# Altium project Simple_EEM_Controller.PrjPCB (part 5 of 5)

## Sheet WR-Clocks.SchDoc: =SheetTitle_Top
size 420 x 297 mm; EDA_Number: ARTIQ; Projet: Simple EEM Controller; Author: G.Kasprowicz; CompanyName: WUT ISE; DrawnBy: G.Kasprowicz; Organization: WUT ISE; Address1: PW ISE; Address2: Nowowiejska 15/19 00-665 Warsaw; Address3: gkasprow@gmail.com; Revision: 1.0; ModifiedBy: -; CheckedDate: -; Title2: WR Clocks; DivGrp: WUT ISE; Designer: G.Kasprowicz; ModifiedDate: -; ProjectName: Sensor Box
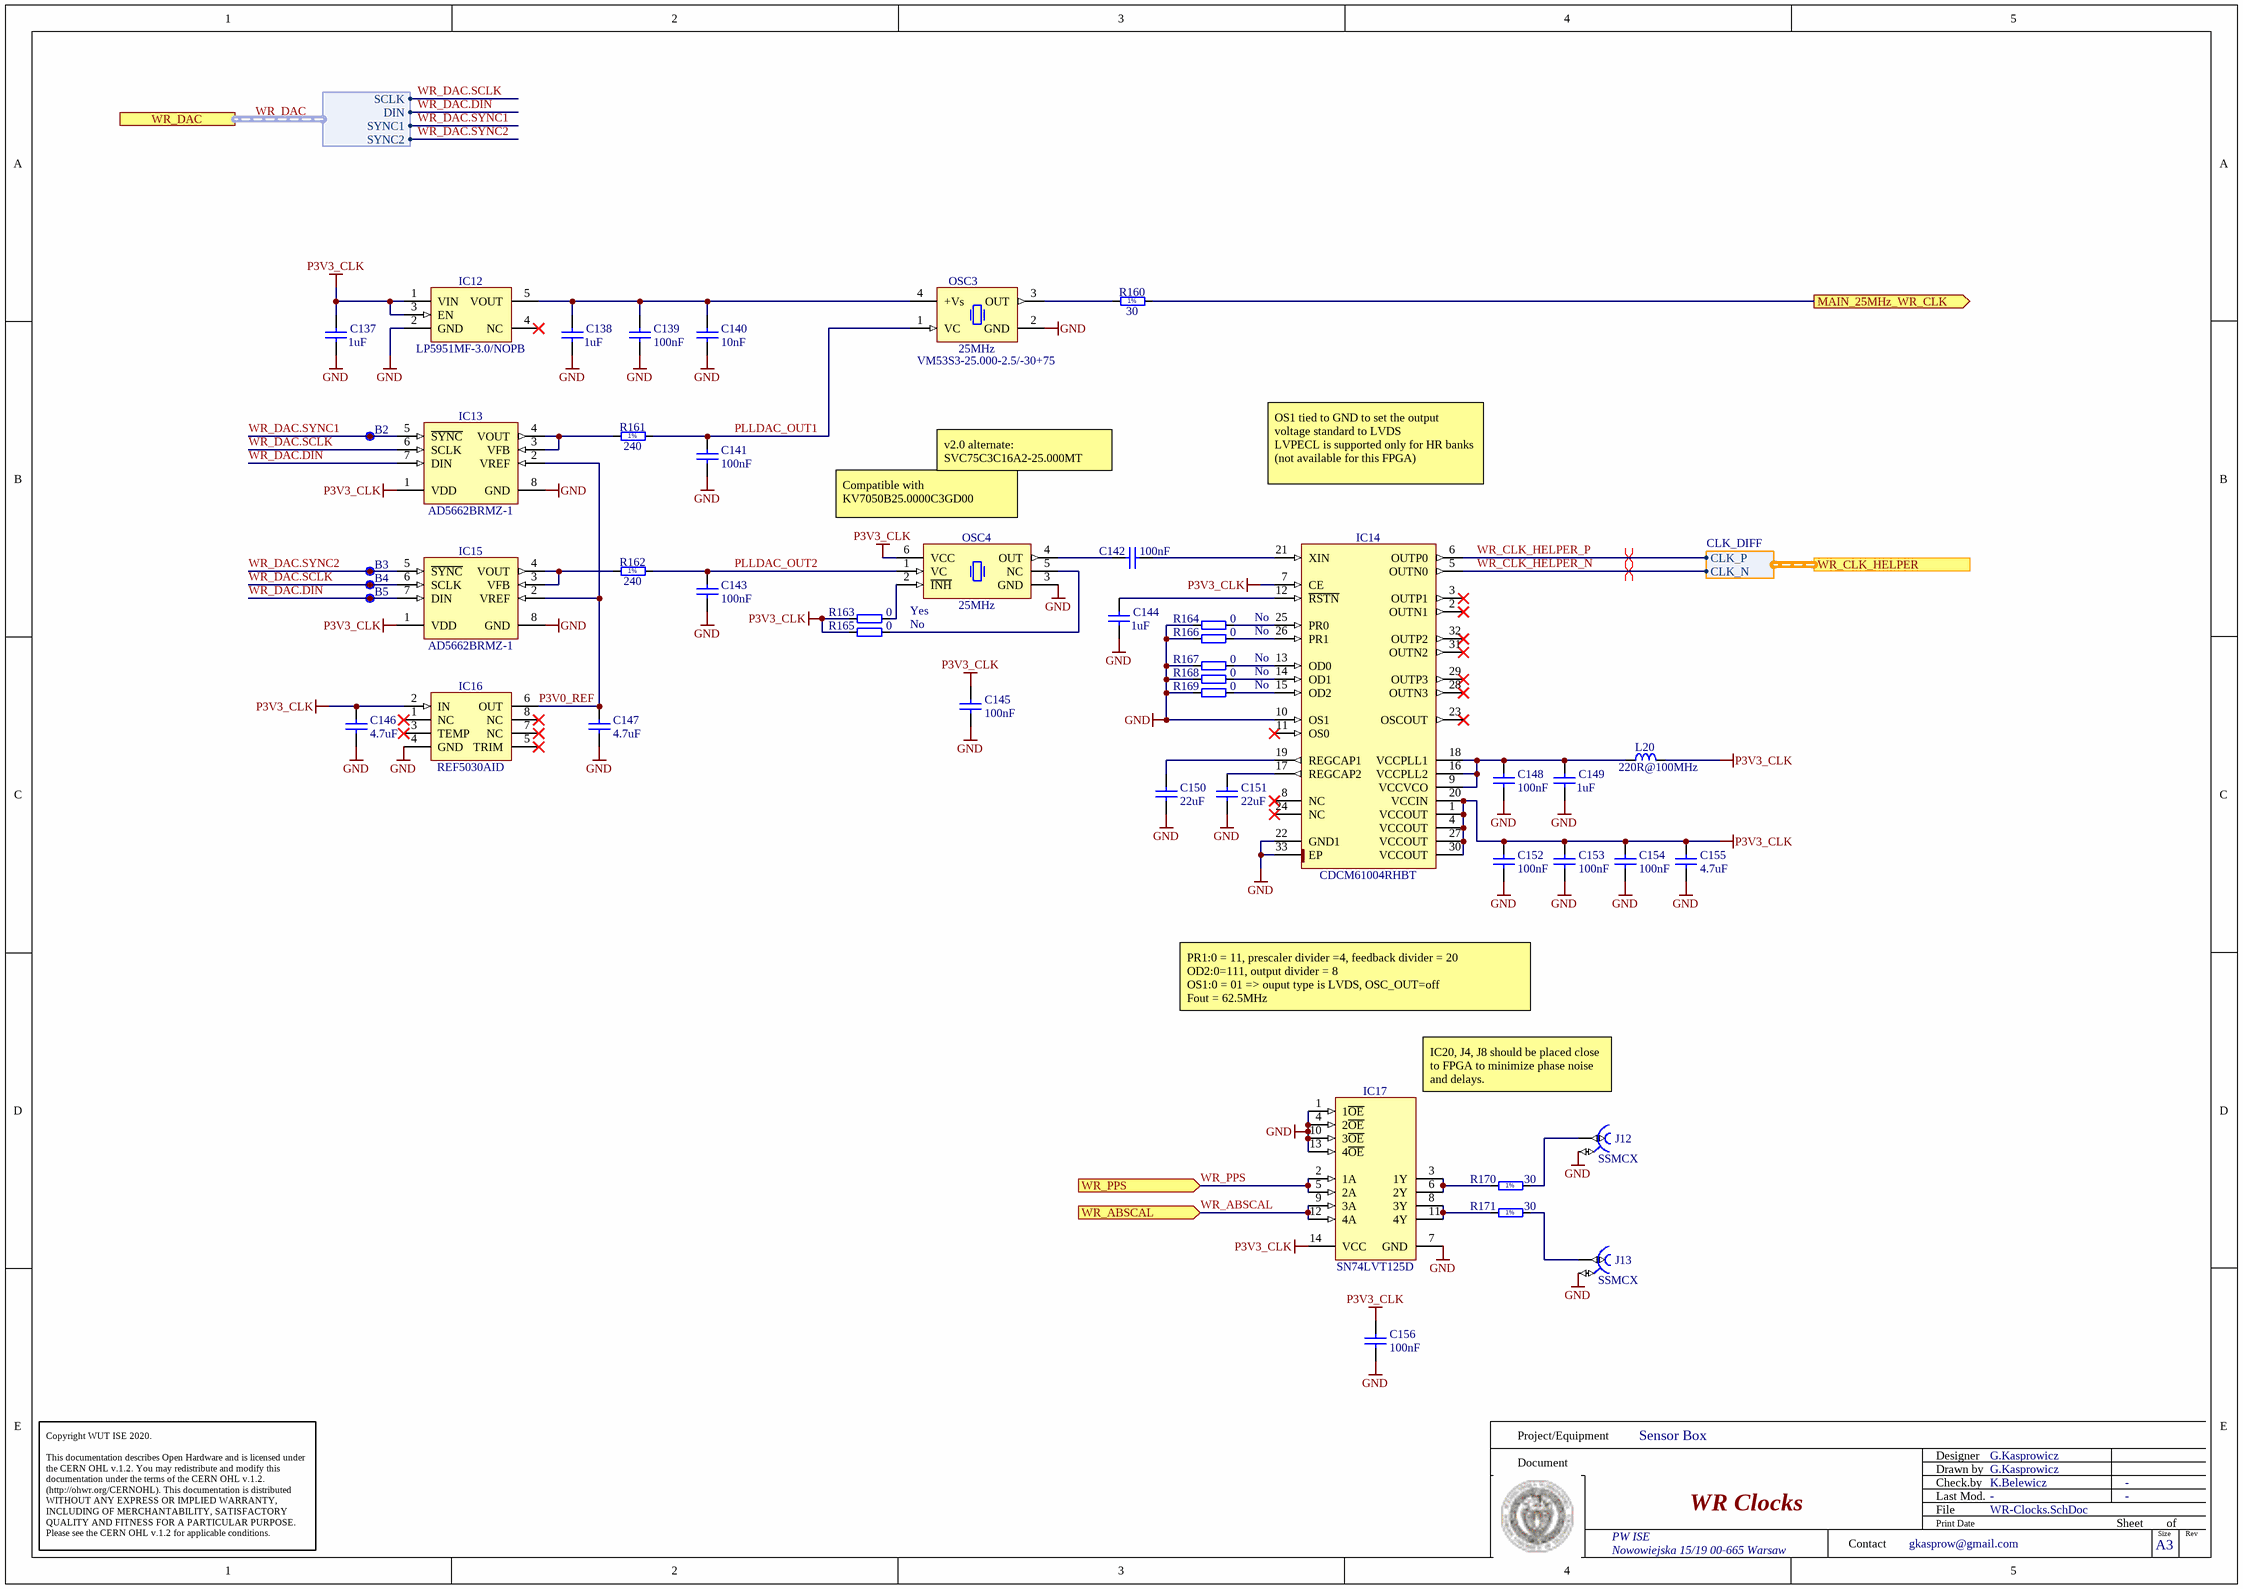
[diagram p10: WR-Clocks.SchDoc]

### Parts
B2  SMD Pad  [C100]  (value not drawn)  (no BOM)
B3  SMD Pad  [C100]  (value not drawn)  (no BOM)
B4  SMD Pad  [C100]  (value not drawn)  (no BOM)
B5  SMD Pad  [C100]  (value not drawn)  (no BOM)
C137  1uF  [CAPC1005X55N]
C138  1uF  [CAPC1005X55N]
C139  100nF  [CAPC1005X55N]
C140  10nF  [CAPC1005X55N]
C141  100nF  [CAPC1005X55N]
C142  100nF  [CAPC1005X55N]
C143  100nF  [CAPC1005X55N]
C144  1uF  [CAPC1005X55N]
C145  100nF  [CAPC1005X55N]
C146  4.7uF  [CAPC1005X55N]
C147  4.7uF  [CAPC1005X55N]
C148  100nF  [CAPC1005X55N]
C149  1uF  [CAPC1005X55N]
C150  22uF  [CAPC1709X100N]
C151  22uF  [CAPC1709X100N]
C152  100nF  [CAPC1005X55N]
C153  100nF  [CAPC1005X55N]
C154  100nF  [CAPC1005X55N]
C155  4.7uF  [CAPC1005X55N]
C156  100nF  [CAPC1005X55N]
IC12  LP5951MF-3.0/NOPB  [SOT95P284X122-5N]
IC13  AD5662BRMZ-1  [SOP65P490X110-8N]
IC14  CDCM61004RHBT  [QFN50P500X500X100-33N-S355]
IC15  AD5662BRMZ-1  [SOP65P490X110-8N]
IC16  REF5030AID  [SOIC127P600X175-8N]
IC17  SN74LVT125D  [SOIC127P600X175-14N]
J12  SSMCX  [MOLEX_73413-0040]
J13  SSMCX  [MOLEX_73413-0040]
L20  220R@100MHz  [INDC2012X105N]
OSC3  25MHz  Manufacturer Part Number: VM53S3-25.000-2.5/-30+75  [OSCCC320X500X160-4N]
OSC4  25MHz  [OSC_KYOCERA_KV7050B-C3]
R160  30  [RESC1005X40N]
R161  240  [RESC1005X40N]
R162  240  [RESC1005X40N]
R163  0  Mounted: Yes  [RESC1005X40N]
R164  0  Mounted: No  [RESC1005X40N]
R165  0  Mounted: No  [RESC1005X40N]
R166  0  Mounted: No  [RESC1005X40N]
R167  0  Mounted: No  [RESC1005X40N]
R168  0  Mounted: No  [RESC1005X40N]
R169  0  Mounted: No  [RESC1005X40N]
R170  30  [RESC1005X40N]
R171  30  [RESC1005X40N]

### Ports
MAIN_25MHz_WR_CLK (out), WR_ABSCAL (in), WR_CLK_HELPER (harness CLK_DIFF), WR_DAC (harness WR_DAC_H), WR_PPS (in)

### Harnesses
WR_DAC_H: SYNC1, SCLK, SYNC2, DIN
CLK_DIFF: CLK_P, CLK_N

### Nets
GND: C137.1 C138.1 C139.1 C140.1 C141.1 C143.1 C144.1 C145.1 C146.1 C147.1 C148.1 C149.1 C150.1 C151.1 C152.1 C153.1 C154.1 C155.1 C156.1 IC12.2(GND) IC13.8(GND) IC14.10(OS1) IC14.22(GND1) IC14.33(EP) IC15.8(GND) IC16.4(GND) IC17.1(1~{OE}) IC17.4(2~{OE}) IC17.7(GND) IC17.10(3~{OE}) IC17.13(4~{OE}) J12.2 J13.2 OSC3.2(GND) OSC4.3(GND) R164.1 R166.1 R167.1 R168.1 R169.1
P3V3_CLK: C137.2 C145.2 C146.2 C152.2 C153.2 C154.2 C155.2 C156.2 IC12.1(VIN) IC12.3(EN) IC13.1(VDD) IC14.1(VCCOUT) IC14.4(VCCOUT) IC14.7(CE) IC14.20(VCCIN) IC14.27(VCCOUT) IC14.30(VCCOUT) IC15.1(VDD) IC16.2(IN) IC17.14(VCC) L20.2 OSC4.6(VCC) R163.1 R165.1
MAIN_25MHz_WR_CLK: R160.2 ; port MAIN_25MHz_WR_CLK
P3V0_REF: C147.2 IC13.2(VREF) IC15.2(VREF) IC16.6(OUT)
PLLDAC_OUT1: C141.2 OSC3.1(VC) R161.2
PLLDAC_OUT2: C143.2 OSC4.1(VC) R162.2
WR_ABSCAL: IC17.9(3A) IC17.12(4A) ; port WR_ABSCAL  [project net HDA.HDA00_CC]
WR_CLK_HELPER_N: IC14.5(OUTN0) ; port WR_CLK_HELPER.CLK_N  [project net HPB15_CC_N]
WR_CLK_HELPER_P: IC14.6(OUTP0) ; port WR_CLK_HELPER.CLK_P  [project net HPB15_CC_P]
WR_DAC.DIN: B5.1 IC13.7(DIN) IC15.7(DIN) ; port WR_DAC.DIN  [project net HDA.HDA05]
WR_DAC.SCLK: B4.1 IC13.6(SCLK) IC15.6(SCLK) ; port WR_DAC.SCLK  [project net HDA.HDA04]
WR_DAC.SYNC1: B2.1 IC13.5(~{SYNC}) ; port WR_DAC.SYNC1  [project net HDA.HDA06]
WR_DAC.SYNC2: B3.1 IC15.5(~{SYNC}) ; port WR_DAC.SYNC2  [project net HDA.HDA07]
WR_PPS: IC17.2(1A) IC17.5(2A) ; port WR_PPS  [project net HDA.HDA01]
NetC138_2: C138.2 C139.2 C140.2 IC12.5(VOUT) OSC3.4(+Vs)
NetC142_1: C142.1 IC14.21(XIN)
NetC142_2: C142.2 OSC4.4(OUT)
NetC144_2: C144.2 IC14.12(~{RSTN})
NetC148_2: C148.2 C149.2 IC14.9(VCCVCO) IC14.16(VCCPLL2) IC14.18(VCCPLL1) L20.1
NetC150_2: C150.2 IC14.19(REGCAP1)
NetC151_2: C151.2 IC14.17(REGCAP2)
NetIC13_3: IC13.3(VFB) IC13.4(VOUT) R161.1
NetIC14_13: IC14.13(OD0) R167.2
NetIC14_14: IC14.14(OD1) R168.2
NetIC14_15: IC14.15(OD2) R169.2
NetIC14_25: IC14.25(PR0) R164.2
NetIC14_26: IC14.26(PR1) R166.2
NetIC15_3: IC15.3(VFB) IC15.4(VOUT) R162.1
NetIC17_3: IC17.3(1Y) IC17.6(2Y) R170.1
NetIC17_8: IC17.8(3Y) IC17.11(4Y) R171.1
NetJ12_1: J12.1 R170.2
NetJ13_1: J13.1 R171.2
NetOSC3_3: OSC3.3(OUT) R160.1
NetOSC4_2: OSC4.2(~{INH}) R163.2
NetOSC4_5: OSC4.5(NC) R165.2

Not connected (* = marked no-connect by the designer): IC12 4(NC)*; IC14 2(OUTN1)* 3(OUTP1)* 8(NC)* 11(OS0)* 23(OSCOUT)* 24(NC)* 28(OUTN3)* 29(OUTP3)* 31(OUTN2)* 32(OUTP2)*; IC16 1(NC)* 3(TEMP)* 5(TRIM)* 7(NC)* 8(NC)*

### Buses and harness runs
harness WR_DAC = port WR_DAC

### Layout directives
differential pair: HPB15_CC_N, HPB15_CC_P

### Notes on the sheet
- (near OSC4) Compatible with KV7050B25.0000C3GD00
- v2.0 alternate: SVC75C3C16A2-25.000MT
- OS1 tied to GND to set the output voltage standard to LVDS
  LVPECL is supported only for HR banks (not available for this FPGA)
- PR1:0 = 11, prescaler divider =4, feedback divider = 20
  OD2:0=111, output divider = 8
  OS1:0 = 01 => ouput type is LVDS, OSC_OUT=off
  Fout = 62.5MHz
- (near IC17) IC20, J4, J8 should be placed close to FPGA to minimize phase noise and delays.
- Project/Equipment
- Document
- Designer
- Drawn by
- Check.by
- Copyright WUT ISE 2020.
  This documentation describes Open Hardware and is licensed under the CERN OHL v.1.2. You may redistribute and modify this documentation under the terms of the CERN OHL v.1.2. (http://ohwr.org/CERNOHL). This documentation is distributed WITHOUT ANY EXPRESS OR IMPLIED WARRANTY, INCLUDING OF MERCHANTABILITY, SATISFACTORY QUALITY AND FITNESS FOR A PARTICULAR PURPOSE. Please see the CERN OHL v.1.2 for applicable conditions.
- Contact
- File
- Last Mod.
- Print Date
- Sheet
- Size
- A3
- of
- Rev
- (in symbol R0402_30R_1%_0.0625W_100PPM) 1%
- (in symbol R0402_240R_1%_0.0625W_100PPM) 1%

### Library data of the parts
B2-B5 = SMD_PAD_D1MM: Through Hole Pad; Part Description: 1mm Diameter SMD Pad; Mounted: No; Part Number: SMD_PAD_D1MM; Component Type: Standard (No BOM); Pin Count: 1; Family: SMD Pad; Socket: No; SMD: No; Sense: No; Status: None; ComponentHeight: 0mm; HelpURL: Undefined; Author: CERN DEM JLC; CreateDate: 10.10.2017; LatestRevisionDate: 10.10.2017; PackageDescription: 1mm Diameter SMD Pad
C137 C138 C144 C149 = CC0402_1UF_16V_10%_X5R: Non-polarised capacitor; Part Description: SMD Multilayer Chip Ceramic Capacitor; Manufacturer: GENERIC; Manufacturer1 Part Number: C1005X5R1C105KT; Voltage: 16V; TC: X5R; Tolerance: ±10%; Part Number: CC0402_1UF_16V_10%_X5R; Component Kind: Standard; Component Type: Standard; Pin Count: 2; Value: 1uF; Status: Preferred; Manufacturer Part Number: CC0402_1UF_16V_10%_X5R; Case: 0402; Mounted: Yes; Socket: No; SMD: Yes; Sense: No; Manufacturer1 Example: TDK; Manufacturer1 ComponentHeight: 0.55mm; HelpURL: \\cern.ch\dfs\Applications\Altium\Datasheets\CC0402_X5R_TDK_C.pdf; Author: CERN DEM JLC; CreateDate: 2012-10-25; LatestRevisionDate: 2012-10-25
C139 C141-C143 C145 C148 C152-C154 C156 = CC0402_100NF_16V_10%_X5R: Non-polarised capacitor; Part Description: SMD Multilayer Chip Ceramic Capacitor; Manufacturer: GENERIC; Manufacturer1 Part Number: GRM155R61C104KA88D; Voltage: 16V; TC: X5R; Tolerance: ±10%; Part Number: CC0402_100NF_16V_10%_X5R; Component Kind: Standard; Component Type: Standard; Pin Count: 2; Value: 100nF; Status: None; Manufacturer Part Number: CC0402_100NF_16V_10%_X5R; Case: 0402; Mounted: Yes; Socket: No; SMD: Yes; Sense: No; Manufacturer1 Example: MURATA; Manufacturer1 ComponentHeight: 0.55mm; HelpURL: \\cern.ch\dfs\Applications\Altium\Datasheets\CC0402_X5R_MURATA_GRM.pdf; Author: CERN DEM JLC; CreateDate: 10.12.2013; LatestRevisionDate: 10.12.2013
C140 = CC0402_10NF_16V_10%_X7R: Non-polarised capacitor; Part Description: SMD Multilayer Chip Ceramic Capacitor; Manufacturer: GENERIC; Manufacturer1 Part Number: 223878715636; Voltage: 16V; TC: X7R; Tolerance: ±10%; Part Number: CC0402_10NF_16V_10%_X7R; Component Kind: Standard; Component Type: Standard; Pin Count: 2; Value: 10nF; Status: Not Recommended; Manufacturer Part Number: CC0402_10NF_16V_10%_X7R; Case: 0402; Mounted: Yes; Socket: No; SMD: Yes; Sense: No; Manufacturer1 Example: PHYCOMP; Manufacturer1 ComponentHeight: 0.55mm; HelpURL: \\cern.ch\dfs\Applications\Altium\Datasheets\CC0402_X7R_PHYCOMP.pdf; Author: CERN DEM JLC; CreateDate: 03.12.2007; LatestRevisionDate: 03.12.2007
C146 C147 C155 = CC0402_4.7UF_6.3V_20%_X5R: Non-polarised capacitor; Part Description: SMD Multilayer Chip Ceramic Capacitor; Manufacturer: GENERIC; Manufacturer1 Part Number: C1005X5R0J475M050BC; Voltage: 6.3V; TC: X5R; Tolerance: ±20%; Part Number: CC0402_4.7UF_6.3V_20%_X5R; Component Kind: Standard; Component Type: Standard; Pin Count: 2; Value: 4.7uF; Status: Preferred; Manufacturer Part Number: CC0402_4.7UF_6.3V_20%_X5R; Case: 0402; Mounted: Yes; Socket: No; SMD: Yes; Manufacturer1 Example: TDK; Manufacturer1 ComponentHeight: 0.65mm; HelpURL: \\cern.ch\dfs\Applications\Altium\Datasheets\CC0402_X5R_TDK_C.pdf; Author: CERN DEM JLC; CreateDate: 03-Mar-15; LatestRevisionDate: 03-Mar-15; Sense: No
C150 C151 = CC0603_22UF_6.3V_20%_X5R: Non-polarised capacitor; Part Description: SMD Multilayer Chip Ceramic Capacitor; Manufacturer: GENERIC; Manufacturer1 Part Number: C1608X5R0J226M080AC; Voltage: 6.3V; TC: X5R; Tolerance: ±20%; Part Number: CC0603_22UF_6.3V_20%_X5R; Component Kind: Standard; Component Type: Standard; Pin Count: 2; Value: 22uF; Status: None; Manufacturer Part Number: CC0603_22UF_6.3V_20%_X5R; Case: 0603; Mounted: Yes; Socket: No; SMD: Yes; Manufacturer1 Example: TDK; Manufacturer1 ComponentHeight: 1mm; HelpURL: \\cern.ch\dfs\Applications\Altium\Datasheets\CC0603_X5R_TDK_C.pdf; Author: CERN DEM JLC; CreateDate: 16-Dec-13; LatestRevisionDate: 13-Sep-16; Sense: No
IC12 = LP5951MF-3.0/NOPB: 150mA Micropower Low-Dropout CMOS Voltage Regulator; Part Description: 3V,  150mA Micropower Low-Dropout CMOS Voltage Regulator; Manufacturer: NATIONAL SEMICONDUCTOR; Table: Regulators; Article#: 16843; Placement Order ID: SMD_SOT&SOD; Part Number: LP5951MF-3.0/NOPB; Component Kind: Standard; Component Type: Standard; Device: LP5951MF-3.0/NOPB; PackageDescription: SOT23 5, Pitch 0.95mm - Body 1.67x2.99mm, IPC Medium Density; Manufacturer Part Number: LP5951MF-3.0/NOPB; Pin Count: 5; Case: SOT23-5; Mounted: Yes; Socket: No; SMD: Yes; ComponentHeight: 1.19mm; HelpURL: \\cern.ch\dfs\Applications\Altium\Datasheets\LP5951MF-3.0-NOPB.pdf; Author: CERN DEM JLC; CreateDate: 24/01/2011; LatestRevisionDate: 24/01/2011
IC13 IC15 = AD5662BRMZ-1: 2.7V to 5.5V, 250uA, Rail-to-Rail Output 16-Bit nanoDAC; Manufacturer: ANALOG DEVICES; Table: Analog & Interface; Article#: 16755; Placement Order ID: SMD_GULL_WING; Part Number: AD5662BRMZ-1; Component Kind: Standard; Component Type: Standard; Device: AD5662BRMZ-1; PackageDescription: SOP, 8-Leads, Body 3.0x3.0mm, Pitch 0.65mm, IPC Medium Density; Part Description: 2.7V to 5.5V, 250uA, Rail-to-Rail Output 16-Bit nanoDAC; Manufacturer Part Number: AD5662BRMZ-1; Pin Count: 8; Case: MSOP8; Mounted: Yes; Socket: No; SMD: Yes; ComponentHeight: 1.1mm; Author: CERN DEM JLC; HelpURL: \\cern.ch\dfs\Applications\Altium\Datasheets\AD5662BRMZ-1.pdf; CreateDate: 1/10/2011; LatestRevisionDate: 1/10/2011
IC14 = CDCM61004RHBT: Four Output, Integrated VCO, Low-Jitter Clock Generator; Manufacturer: TEXAS INSTRUMENTS; Table: Logic; Article#: 16910; Placement Order ID: SMD_PASTE; Part Number: CDCM61004RHBT; Component Kind: Standard; Component Type: Standard; Device: CDCM61004RHBT; PackageDescription: QFN, (MO-220-VHHD-4) 0.50mm pitch,square; 8 pin X 8 pin, 5mm X 5mm X 1.00mm H body (w/thermal tab 3.5 X 3.5mm),  IPC Medium Density; Part Description: Four Output, Integrated VCO, Low-Jitter Clock Generator; Manufacturer Part Number: CDCM61004RHBT; Pin Count: 33; Case: QFN32; Mounted: Yes; Socket: No; SMD: Yes; ComponentHeight: 1mm; HelpURL: \\cern.ch\dfs\Applications\Altium\Datasheets\CDCM61004RHBT.pdf; Author: CERN DEM JLC; CreateDate: 25/08/2010; LatestRevisionDate: 21/11/2011
IC16 = REF5030AID: Low-Noise, Very Low Drift, Precision Voltage Reference; Part Description: 3V, Low-Noise, Very Low Drift, Precision Voltage Reference; Manufacturer: TEXAS INSTRUMENTS; PressFit: No; Bonding: No; Part Number: REF5030AID; Component Kind: Standard; Component Type: Standard; Device: REF5030AID; PackageDescription: SOIC 8, Pitch 1.27mm, Body 4x5mm, IPC Medium Density; Manufacturer Part Number: REF5030AID; Pin Count: 8; Case: SOIC8; Mounted: Yes; Socket: No; SMD: Yes; ComponentHeight: 1.75mm; HelpURL: \\cern.ch\dfs\Applications\Altium\Datasheets\REF5030AID.pdf; Author: CERN DEM MR; CreateDate: 14-Oct-16; LatestRevisionDate: 14-Oct-16; Sense: No
IC17 = SN74LVT125D: Quadruple Bus Buffer with 3-State Outputs; Part Description: 3.3V ABT Quadruple Bus Buffer with 3-State Outputs; Manufacturer: TEXAS INSTRUMENTS; PressFit: No; Bonding: No; Part Number: SN74LVT125D; Component Kind: Standard; Component Type: Standard; Device: SN74LVT125D; PackageDescription: SOIC 14, Pitch 1.27mm - Body 4x8.75mm, IPC Medium Density; Manufacturer Part Number: SN74LVT125D; Pin Count: 14; Case: SOIC14; Mounted: Yes; Socket: No; SMD: Yes; Sense: No; ComponentHeight: 1.75mm; Author: CERN DEM JLC; HelpURL: \\cern.ch\dfs\Applications\Altium\Datasheets\SN74LVT125D.pdf; CreateDate: 01-Jun-11; LatestRevisionDate: 01-Jun-11
J12 J13 = MOLEX_73413-0040: Part Description: 50 Ohm, Magnetic Vertical SSMCX Jack; Manufacturer: MOLEX; PressFit: No; Part Number: MOLEX_73413-0040; Component Kind: Standard; Component Type: Standard; Pin Count: 2; Family: SSMCX; Mounted: Yes; Socket: No; SMD: Yes; Sense: No; Status: None; Manufacturer Part Number: 73413-0040; ComponentHeight: 3.35mm; HelpURL: \\cern.ch\dfs\Applications\Altium\Datasheets\MOLEX_73413-0040.pdf; Author: CERN DEM JLC; CreateDate: 31-May-17; LatestRevisionDate: 29-Jan-18
L20 = IND0805_MURATA_BLM21PG221SN1D: Inductor; Part Description: SMD EMIFIL Suppression Chip Ferrite Bead; Manufacturer: MURATA; Power: 2A; Resistance: 0.05R; Tolerance: ±25%; Table: Inductors SMD; Part Number: IND0805_MURATA_BLM21PG221SN1D; Component Kind: Standard; Component Type: Standard; Pin Count: 2; Value: 220R@100MHz; Status: None; Manufacturer Part Number: BLM21PG221SN1D; Case: 0805; Mounted: Yes; Socket: No; SMD: Yes; ComponentHeight: 1.05mm; HelpURL: \\cern.ch\dfs\Applications\Altium\Datasheets\IND0402_MURATA_BLM21P.pdf; Author: CERN DEM JLC; CreateDate: 25/01/2010; LatestRevisionDate: 25/01/2010
OSC3 = OSC_25MHZ_MERCURY_VM53S3-25.000-2.5/-30+75: Oscillator 4 pins 1=VC 2=GND 3=OUT 4=+Vs; Part Description: 3V ±2.5ppmVoltage Controlled Temperature Compensated Crystal Oscillator VM53S3 Serie; Manufacturer: MERCURY ELECTRONICS; Table: Crystals & Oscillators; Article#: 16765; Placement Order ID: SMD_LEADLESS; Part Number: OSC_25MHZ_MERCURY_VM53S3-25.000-2.5/-30+75; Component Kind: Standard; Component Type: Standard; PackageDescription: SMD Oscillator, Corner Convave, 4 pins, 5x3.2mm; Value: 25MHz; Pin Count: 4; Mounted: Yes; Socket: No; SMD: Yes; ComponentHeight: 1.6mm; HelpURL: \\cern.ch\dfs\Applications\Altium\Datasheets\OSC_MERCURY_VM53S3.pdf; Author: CERN DEM JLC; CreateDate: 1/20/2010; LatestRevisionDate: 1/24/2011
OSC4 = OSC_25MHZ_KYOCERA_KV7050B25.0000C3GD00: Oscillator KYOCERA; Part Description: ±50ppm, 15pF, Supply Voltage 3.3V, -40°C to +85°C, Surface Mount Crystal Oscillator VCXO, KV7050B-C3 Series; PressFit: No; Bonding: No; Part Number: OSC_25MHZ_KYOCERA_KV7050B25.0000C3GD00; Component Kind: Standard; Component Type: Standard; PackageDescription: SMD Crystal Kyocera, 6 Pin, 7mm L X 5mm W X 1.6mm H; Value: 25MHz; Manufacturer: KYOCERA; Manufacturer Part Number: KV7050B25.0000C3GD00; Pin Count: 6; Mounted: Yes; Socket: No; SMD: Yes; Sense: No; ComponentHeight: 1.6mm; HelpURL: \\cern.ch\dfs\Applications\Altium\Datasheets\OSC_KYOCERA_KV7050B-C3.pdf; Author: CERN DEM MR; CreateDate: 01.10.2019; LatestRevisionDate: 01.10.2019
R160 R170 R171 = R0402_30R_1%_0.0625W_100PPM: Resistor - 1%; Part Description: General Purpose Thick Film Chip Resistor; Manufacturer: GENERIC; Manufacturer1 Part Number: 232270673009L; TC: ±100ppm/°C; PressFit: No; Part Number: R0402_30R_1%_0.0625W_100PPM; Component Kind: Standard; Component Type: Standard; Pin Count: 2; Value: 30; Status: Not Recommended; Power: 0.0625W; Tolerance: ±1%; Manufacturer Part Number: R0402_30R_1%_0.0625W_100PPM; Case: 0402; Mounted: Yes; Socket: No; SMD: Yes; Manufacturer1 Example: YAGEO PHYCOMP; Manufacturer1 ComponentHeight: 0.4mm; HelpURL: \\cern.ch\dfs\Applications\Altium\Datasheets\R0402_Phycomp_RC0402.pdf; Author: CERN DEM JLC; CreateDate: 03/12/2007; LatestRevisionDate: 17/10/2012; Sense: No
R161 R162 = R0402_240R_1%_0.0625W_100PPM: Resistor - 1%; Part Description: General Purpose Thick Film Chip Resistor; Manufacturer: GENERIC; Manufacturer1 Part Number: 232270672401L; TC: ±100ppm/°C; PressFit: No; Part Number: R0402_240R_1%_0.0625W_100PPM; Component Kind: Standard; Component Type: Standard; Pin Count: 2; Value: 240; Status: Not Recommended; Power: 0.0625W; Tolerance: ±1%; Manufacturer Part Number: R0402_240R_1%_0.0625W_100PPM; Case: 0402; Mounted: Yes; Socket: No; SMD: Yes; Manufacturer1 Example: YAGEO PHYCOMP; Manufacturer1 ComponentHeight: 0.4mm; HelpURL: \\cern.ch\dfs\Applications\Altium\Datasheets\R0402_Phycomp_RC0402.pdf; Author: CERN DEM JLC; CreateDate: 03-Dec-07; LatestRevisionDate: 17-Oct-12; Sense: No
R163-R169 = R0402_0R_JUMPER: Resistor; Part Description: 1A (0.05R Max DC Resistance) Zero Ohm Jumper; Manufacturer: GENERIC; Manufacturer1 Part Number: 232270591001L; PressFit: No; Part Number: R0402_0R_JUMPER; Component Kind: Standard; Component Type: Standard; Pin Count: 2; Value: 0; Status: Not Recommended; Manufacturer Part Number: R0402_0R_JUMPER; Case: 0402; Sense: No; Socket: No; SMD: Yes; Manufacturer1 Example: YAGEO PHYCOMP; Manufacturer1 ComponentHeight: 0.4mm; HelpURL: \\cern.ch\dfs\Applications\Altium\Datasheets\R0402_Phycomp_RC0402.pdf; Author: CERN DEM JLC; CreateDate: 03.12.2007; LatestRevisionDate: 17.10.2012

## Nets that join several sheets
CHASSIS: Simple_EEM_Controller (C97.1 M2.1 R129.1 R220.2), Connector_ETH (J3.SHIELD)
GND: Simple_EEM_Controller (5 pins), Connector_SFP (61 pins), Connector_ETH (40 pins), Connector_EEM (52 pins), Connector_SOM240_1 (108 pins), Connector_SOM240_2 (86 pins), Connector_SOM40 (24 pins), Power_Supply (88 pins), Clocks (26 pins), WR-Clocks (40 pins)
P1V1_ETH: Connector_ETH (L13.1 L14.1 L15.1), Power_Supply (5 pins)
P1V8_CLK: Power_Supply (C105.2 C106.2 L19.2 TP16.1), Clocks (29 pins)
P1V8_ETH: Connector_ETH (L12.1), Power_Supply (5 pins)
P1V8_SOM_PL: Connector_SOM240_1 (5 pins), Connector_SOM240_2 (8 pins), Power_Supply (7 pins), Clocks (C118.2 OSC2.1 OSC2.4)
P3V3_CLK: Power_Supply (C101.2 C102.2 L17.2 TP15.1), Clocks (11 pins), WR-Clocks (24 pins)
P3V3_EEM: Connector_EEM (28 pins), Power_Supply (L21.2 R177.2 TP4.1)
P3V3_ETH: Connector_ETH (J3.11 J3.13 L11.1), Power_Supply (9 pins)
P3V3_SFP: Connector_SFP (20 pins), Power_Supply (L22.2 R178.2 TP19.1)
P3V3_SOM_PL: Connector_EEM (R132.2 R133.2), Connector_SOM240_1 (C76.2 C77.2 J5.B13 J5.B14), Connector_SOM240_2 (6 pins), Power_Supply (16 pins)
P5V0_SOM: Connector_SOM240_1 (12 pins), Power_Supply (20 pins)
P12V0: Connector_EEM (8 pins), Power_Supply (17 pins)
ETH_MDC: Connector_ETH (IC2.51 R84.1), Connector_SOM240_1 (J5.D37)
ETH_MDIO: Connector_ETH (IC2.52 R83.1), Connector_SOM240_1 (J5.D36)
ETH_RX_CLK: Connector_ETH (R88.2 R99.1), Connector_SOM240_1 (J5.D41)
ETH_RX_CTL: Connector_ETH (R93.2 R98.1 R101.2), Connector_SOM240_1 (J5.D45)
ETH_RXD0: Connector_ETH (R89.2 R104.2), Connector_SOM240_1 (J5.C39)
ETH_RXD1: Connector_ETH (R90.2 R103.2), Connector_SOM240_1 (J5.D42)
ETH_RXD2: Connector_ETH (R91.2 R102.2), Connector_SOM240_1 (J5.B44)
ETH_RXD3: Connector_ETH (R92.2 R100.1), Connector_SOM240_1 (J5.D44)
ETH_TX_CLK: Connector_ETH (IC2.33), SOM (R56.2)
ETH_TX_CTL: Connector_ETH (IC2.34), SOM (R47.2)
ETH_TXD0: Connector_ETH (IC2.22), SOM (R52.2)
ETH_TXD1: Connector_ETH (IC2.23), SOM (R54.2)
ETH_TXD2: Connector_ETH (IC2.24), SOM (R50.2)
ETH_TXD3: Connector_ETH (IC2.25), SOM (R48.2)
EXT0.LVDS_N0: Connector_EEM (J8.3), Connector_SOM240_1 (J5.C4)
EXT0.LVDS_N1: Connector_EEM (J8.6), Connector_SOM240_1 (J5.D8)
EXT0.LVDS_N2: Connector_EEM (J8.9), Connector_SOM240_1 (J5.D5)
EXT0.LVDS_N3: Connector_EEM (J8.12), Connector_SOM240_1 (J5.C7)
EXT0.LVDS_N4: Connector_EEM (J8.15), Connector_SOM240_1 (J5.B5)
EXT0.LVDS_N5: Connector_EEM (J8.18), Connector_SOM240_1 (J5.B2)
EXT0.LVDS_N6: Connector_EEM (J8.21), Connector_SOM240_1 (J5.A4)
EXT0.LVDS_N7: Connector_EEM (J8.24), Connector_SOM240_1 (J5.B8)
EXT0.LVDS_P0: Connector_EEM (J8.2), Connector_SOM240_1 (J5.C3)
EXT0.LVDS_P1: Connector_EEM (J8.5), Connector_SOM240_1 (J5.D7)
EXT0.LVDS_P2: Connector_EEM (J8.8), Connector_SOM240_1 (J5.D4)
EXT0.LVDS_P3: Connector_EEM (J8.11), Connector_SOM240_1 (J5.C6)
EXT0.LVDS_P4: Connector_EEM (J8.14), Connector_SOM240_1 (J5.B4)
EXT0.LVDS_P5: Connector_EEM (J8.17), Connector_SOM240_1 (J5.B1)
EXT0.LVDS_P6: Connector_EEM (J8.20), Connector_SOM240_1 (J5.A3)
EXT0.LVDS_P7: Connector_EEM (J8.23), Connector_SOM240_1 (J5.B7)
EXT1.LVDS_N0: Connector_EEM (J9.3), Connector_SOM240_1 (J5.C13)
EXT1.LVDS_N1: Connector_EEM (J9.6), Connector_SOM240_1 (J5.C10)
EXT1.LVDS_N2: Connector_EEM (J9.9), Connector_SOM240_1 (J5.D11)
EXT1.LVDS_N3: Connector_EEM (J9.12), Connector_SOM240_1 (J5.A10)
EXT1.LVDS_N4: Connector_EEM (J9.15), Connector_SOM240_1 (J5.A13)
EXT1.LVDS_N5: Connector_EEM (J9.18), Connector_SOM240_1 (J5.D14)
EXT1.LVDS_N6: Connector_EEM (J9.21), SOM (R139#2.2 R150.2)
EXT1.LVDS_N7: Connector_EEM (J9.24), SOM (R28.2 R46.2)
EXT1.LVDS_P0: Connector_EEM (J9.2), Connector_SOM240_1 (J5.C12)
EXT1.LVDS_P1: Connector_EEM (J9.5), Connector_SOM240_1 (J5.C9)
EXT1.LVDS_P2: Connector_EEM (J9.8), Connector_SOM240_1 (J5.D10)
EXT1.LVDS_P3: Connector_EEM (J9.11), Connector_SOM240_1 (J5.A9)
EXT1.LVDS_P4: Connector_EEM (J9.14), Connector_SOM240_1 (J5.A12)
EXT1.LVDS_P5: Connector_EEM (J9.17), Connector_SOM240_1 (J5.D13)
EXT1.LVDS_P6: Connector_EEM (J9.20), SOM (R131.2 R140#2.2)
EXT1.LVDS_P7: Connector_EEM (J9.23), SOM (R27.2 R45.2)
EXT2.LVDS_N0: Connector_EEM (J10.3), SOM (R30.2 R51.2)
EXT2.LVDS_N1: Connector_EEM (J10.6), SOM (R32.2 R55.2)
EXT2.LVDS_N2: Connector_EEM (J10.9), SOM (R34.2 R58.2)
EXT2.LVDS_N3: Connector_EEM (J10.12), SOM (R36.2 R60.2)
EXT2.LVDS_N4: Connector_EEM (J10.15), SOM (R38.2 R62.2)
EXT2.LVDS_N5: Connector_EEM (J10.18), SOM (R40.2 R64.2)
EXT2.LVDS_N6: Connector_EEM (J10.21), SOM (R42.2 R66.2)
EXT2.LVDS_N7: Connector_EEM (J10.24), SOM (R44.2 R68.2)
EXT2.LVDS_P0: Connector_EEM (J10.2), SOM (R29.2 R49.2)
EXT2.LVDS_P1: Connector_EEM (J10.5), SOM (R31.2 R53.2)
EXT2.LVDS_P2: Connector_EEM (J10.8), SOM (R33.2 R57.2)
EXT2.LVDS_P3: Connector_EEM (J10.11), SOM (R35.2 R59.2)
EXT2.LVDS_P4: Connector_EEM (J10.14), SOM (R37.2 R61.2)
EXT2.LVDS_P5: Connector_EEM (J10.17), SOM (R39.2 R63.2)
EXT2.LVDS_P6: Connector_EEM (J10.20), SOM (R41.2 R65.2)
EXT2.LVDS_P7: Connector_EEM (J10.23), SOM (R43.2 R67.2)
EXT3.LVDS_N0: Connector_EEM (J11.3), Connector_SOM240_2 (J7.D16)
EXT3.LVDS_N1: Connector_EEM (J11.6), Connector_SOM240_2 (J7.D13)
EXT3.LVDS_N2: Connector_EEM (J11.9), Connector_SOM240_2 (J7.C18)
EXT3.LVDS_N3: Connector_EEM (J11.12), Connector_SOM240_2 (J7.B25)
EXT3.LVDS_N4: Connector_EEM (J11.15), Connector_SOM240_2 (J7.D22)
EXT3.LVDS_N5: Connector_EEM (J11.18), Connector_SOM240_2 (J7.B19)
EXT3.LVDS_N6: Connector_EEM (J11.21), Connector_SOM240_2 (J7.A21)
EXT3.LVDS_N7: Connector_EEM (J11.24), Connector_SOM240_2 (J7.B16)
EXT3.LVDS_P0: Connector_EEM (J11.2), Connector_SOM240_2 (J7.D15)
EXT3.LVDS_P1: Connector_EEM (J11.5), Connector_SOM240_2 (J7.D12)
EXT3.LVDS_P2: Connector_EEM (J11.8), Connector_SOM240_2 (J7.C17)
EXT3.LVDS_P3: Connector_EEM (J11.11), Connector_SOM240_2 (J7.B24)
EXT3.LVDS_P4: Connector_EEM (J11.14), Connector_SOM240_2 (J7.D21)
EXT3.LVDS_P5: Connector_EEM (J11.17), Connector_SOM240_2 (J7.B18)
EXT3.LVDS_P6: Connector_EEM (J11.20), Connector_SOM240_2 (J7.A20)
EXT3.LVDS_P7: Connector_EEM (J11.23), Connector_SOM240_2 (J7.B15)
EXT_I2C.RESET: Connector_EEM (R142.2 T11.1), Connector_SOM240_1 (J5.B22)
EXT_I2C.SCL: Connector_EEM (IC4.19 R133.1), Connector_SOM240_1 (J5.C23)
EXT_I2C.SDA: Connector_EEM (IC4.20 R132.1), Connector_SOM240_1 (J5.C22)
FPGA_CLK_OUT_N: Connector_SOM240_1 (J5.B11), Clocks (C111.2)
FPGA_CLK_OUT_P: Connector_SOM240_1 (J5.B10), Clocks (C109.2)
FPGA_PL_CLKREF_N: Connector_SOM240_1 (J5.A7), Clocks (IC11.41)
FPGA_PL_CLKREF_P: Connector_SOM240_1 (J5.A6), Clocks (IC11.42)
GTH_CLK.GTH_REFCLK0_N: Connector_SOM240_2 (J7.C4), Clocks (C108.1)
GTH_CLK.GTH_REFCLK0_P: Connector_SOM240_2 (J7.C3), Clocks (C98.1)
GTH_CLK.GTH_REFCLK1_N: Connector_SOM240_2 (J7.A8), Clocks (C112.1)
GTH_CLK.GTH_REFCLK1_P: Connector_SOM240_2 (J7.A7), Clocks (C110.1)
GTH_DATA.GTH_DP0_C2M_N: Connector_SFP (J1.12), Connector_SOM240_2 (J7.B10)
GTH_DATA.GTH_DP0_C2M_P: Connector_SFP (J1.13), Connector_SOM240_2 (J7.B9)
GTH_DATA.GTH_DP0_M2C_N: Connector_SFP (J1.19), Connector_SOM240_2 (J7.D10)
GTH_DATA.GTH_DP0_M2C_P: Connector_SFP (J1.18), Connector_SOM240_2 (J7.D9)
GTH_DATA.GTH_DP1_C2M_N: Connector_SFP (J2.12), Connector_SOM240_2 (J7.D2)
GTH_DATA.GTH_DP1_C2M_P: Connector_SFP (J2.13), Connector_SOM240_2 (J7.D1)
GTH_DATA.GTH_DP1_M2C_N: Connector_SFP (J2.19), Connector_SOM240_2 (J7.C8)
GTH_DATA.GTH_DP1_M2C_P: Connector_SFP (J2.18), Connector_SOM240_2 (J7.C7)
HDA.HDA00_CC: Connector_SOM240_1 (J5.D16), WR-Clocks (IC17.9 IC17.12)
HDA.HDA01: Connector_SOM240_1 (J5.D17), WR-Clocks (IC17.2 IC17.5)
HDA.HDA02: Connector_SOM240_1 (J5.D18), Clocks (IC11.18 R157.2)
HDA.HDA03: Connector_SOM240_1 (J5.B16), Clocks (IC11.16 R156.2)
HDA.HDA04: Connector_SOM240_1 (J5.B17), WR-Clocks (B4.1 IC13.6 IC15.6)
HDA.HDA05: Connector_SOM240_1 (J5.B18), WR-Clocks (B5.1 IC13.7 IC15.7)
HDA.HDA06: Connector_SOM240_1 (J5.C18), WR-Clocks (B2.1 IC13.5)
HDA.HDA07: Connector_SOM240_1 (J5.C19), WR-Clocks (B3.1 IC15.5)
HDA.HDA14: Connector_SOM240_1 (J5.D22), Power_Supply (IC5.3 R172.2 TP20.1)
HDA.HDA15: Connector_SOM240_1 (J5.B20), Power_Supply (IC5.4 R173.2 TP17.1)
HDB.HDB00_CC: Connector_SFP (J1.2 R70.1), Connector_SOM240_2 (J7.D44)
HDB.HDB01: Connector_SFP (J1.3), Connector_SOM240_2 (J7.D45)
HDB.HDB02: Connector_SFP (J1.4 R71.1), Connector_SOM240_2 (J7.D46)
HDB.HDB03: Connector_SFP (J1.5 R72.1), Connector_SOM240_2 (J7.D48)
HDB.HDB04: Connector_SFP (J1.6 R73.1), Connector_SOM240_2 (J7.D49)
HDB.HDB05: Connector_SFP (J1.7 R75.2), Connector_SOM240_2 (J7.D50)
HDB.HDB06: Connector_SFP (J1.8 R74.1), Connector_SOM240_2 (J7.C46)
HDB.HDB07: Connector_SFP (R151.2 T7.1), Connector_SOM240_2 (J7.C47)
HDB.HDB08_CC: Connector_SFP (J2.2 R77.1), Connector_SOM240_2 (J7.C48)
HDB.HDB09: Connector_SFP (J2.3), Connector_SOM240_2 (J7.C50)
HDB.HDB10: Connector_SFP (J2.4 R78.1), Connector_SOM240_2 (J7.C51)
HDB.HDB11: Connector_SFP (J2.5 R79.1), Connector_SOM240_2 (J7.C52)
HDB.HDB12: Connector_SFP (J2.6 R80.1), Connector_SOM240_2 (J7.B44)
HDB.HDB13: Connector_SFP (J2.7 R82.2), Connector_SOM240_2 (J7.B45)
HDB.HDB14: Connector_SFP (J2.8 R81.1), Connector_SOM240_2 (J7.B46)
HDB.HDB15: Connector_SFP (R152.2 T8.1), Connector_SOM240_2 (J7.B48)
HPA15_CC_N: SOM (R139#2.1), Connector_SOM40 (J4.C02)
HPA15_CC_P: SOM (R131.1), Connector_SOM40 (J4.C01)
HPA16_N: SOM (R28.1), Connector_SOM40 (J4.A02)
HPA16_P: SOM (R27.1), Connector_SOM40 (J4.A01)
HPA17_N: SOM (R32.1), Connector_SOM40 (J4.D03)
HPA17_P: SOM (R31.1), Connector_SOM40 (J4.D02)
HPA18_N: SOM (R34.1), Connector_SOM40 (J4.B03)
HPA18_P: SOM (R33.1), Connector_SOM40 (J4.B02)
HPA19_N: SOM (R36.1), Connector_SOM40 (J4.C05)
HPA19_P: SOM (R35.1), Connector_SOM40 (J4.C04)
HPA20_CC_N: SOM (R30.1), Connector_SOM40 (J4.A05)
HPA20_CC_P: SOM (R29.1), Connector_SOM40 (J4.A04)
HPA21_N: SOM (R38.1), Connector_SOM40 (J4.D06)
HPA21_P: SOM (R37.1), Connector_SOM40 (J4.D05)
HPA22_N: SOM (R40.1), Connector_SOM40 (J4.B06)
HPA22_P: SOM (R39.1), Connector_SOM40 (J4.B05)
HPA23_N: SOM (R42.1), Connector_SOM40 (J4.C08)
HPA23_P: SOM (R41.1), Connector_SOM40 (J4.C07)
HPA24_N: SOM (R44.1), Connector_SOM40 (J4.A08)
HPA24_P: SOM (R43.1), Connector_SOM40 (J4.A07)
HPB08_N: SOM (R55.1), Connector_SOM240_2 (J7.A15)
HPB08_P: SOM (R53.1), Connector_SOM240_2 (J7.A14)
HPB09_N: SOM (R58.1), Connector_SOM240_2 (J7.C12)
HPB09_P: SOM (R57.1), Connector_SOM240_2 (J7.C11)
HPB10_CC_N: SOM (R51.1), Connector_SOM240_2 (J7.B13)
HPB10_CC_P: SOM (R49.1), Connector_SOM240_2 (J7.B12)
HPB11_N: SOM (R60.1), Connector_SOM240_2 (J7.B22)
HPB11_P: SOM (R59.1), Connector_SOM240_2 (J7.B21)
HPB12_N: SOM (R62.1), Connector_SOM240_2 (J7.A18)
HPB12_P: SOM (R61.1), Connector_SOM240_2 (J7.A17)
HPB13_N: SOM (R64.1), Connector_SOM240_2 (J7.C21)
HPB13_P: SOM (R63.1), Connector_SOM240_2 (J7.C20)
HPB14_N: SOM (R66.1), Connector_SOM240_2 (J7.C15)
HPB14_P: SOM (R65.1), Connector_SOM240_2 (J7.C14)
HPB15_CC_N: Connector_SOM240_2 (J7.A12), WR-Clocks (IC14.5)
HPB15_CC_P: Connector_SOM240_2 (J7.A11), WR-Clocks (IC14.6)
HPB16_N: SOM (R68.1), Connector_SOM240_2 (J7.A24)
HPB16_P: SOM (R67.1), Connector_SOM240_2 (J7.A23)
HPB17_N: SOM (R150.1), Connector_SOM240_2 (J7.D25)
HPB17_P: SOM (R140#2.1), Connector_SOM240_2 (J7.D24)
HPB18_N: SOM (R46.1), Connector_SOM240_2 (J7.C24)
HPB18_P: SOM (R45.1), Connector_SOM240_2 (J7.C23)
HPB_0-7.HPB_CLK0_N: Connector_SOM240_2 (J7.D19), Clocks (IC11.44)
HPB_0-7.HPB_CLK0_P: Connector_SOM240_2 (J7.D18), Clocks (IC11.45)
MAIN_25MHz_WR_CLK: Clocks (C96.2), WR-Clocks (R160.2)
MIO46: Connector_SOM240_1 (J5.D34), Clocks (R159.2)
MIO55: SOM (R56.1), Connector_SOM240_1 (J5.C38)
MIO61: Connector_ETH (IC2.58 R109.1), Connector_SOM240_1 (J5.A38)
MIO62: SOM (R52.1), Connector_SOM240_1 (J5.A39)
MIO63: SOM (R54.1), Connector_SOM240_1 (J5.A40)
MIO67: SOM (R47.1), Connector_SOM240_1 (J5.C42)
MIO69: SOM (R50.1), Connector_SOM240_1 (J5.C44)
MIO74: SOM (R48.1), Connector_SOM240_1 (J5.A43)
PS_ERROR_OUT_M2C: SOM (TP6.1), Connector_SOM240_1 (J5.B24)
PS_ERROR_STATUS_M2C: SOM (TP7.1), Connector_SOM240_1 (J5.B25)
PS_POR: Connector_SOM240_1 (J5.C15), Power_Supply (IC1.2)
PS_SRST_C2M: SOM (TP5.1), Connector_SOM240_1 (D2.1 J5.C16 J6.14)
PWRGD_FPD_M2C: Connector_SOM240_1 (J5.D24), Power_Supply (T5.1)
PWRGD_LPD_M2C: Connector_SOM240_1 (J5.D25), Power_Supply (T4.1)
PWRGD_PL_M2C: Connector_SOM240_1 (J5.D26), Power_Supply (T3.1)
PWROFF_C2M: Connector_SOM240_1 (J5.B26), Power_Supply (T2.3)
VCCOEN_PL_M2C: Connector_SOM240_1 (J5.A20), Power_Supply (R12.1)
VCCOEN_PS_M2C: Connector_SOM240_1 (J5.A19), Power_Supply (IC7.1 IC9.1 R25.2)

## Assembly variants
K24: not fitted MP1 MP2 OSC1 R45 R46 R49 R51 R53 R55 R57 R58 R59 R60 R61 R62 R63 R64 R65 R66 R67 R68 R115 R116 R117 R118 R140 R150 R164 R165 R166 R167 R168 R169 SCREW1 SCREW2 SCREW3 SCREW4 SOM2
K26: not fitted OSC1 R27 R28 R29 R30 R31 R32 R33 R34 R35 R36 R37 R38 R39 R40 R41 R42 R43 R44 R115 R116 R117 R118 R131 R139 R164 R165 R166 R167 R168 R169 SCREW5 SCREW6 SCREW7 SCREW8 SOM1